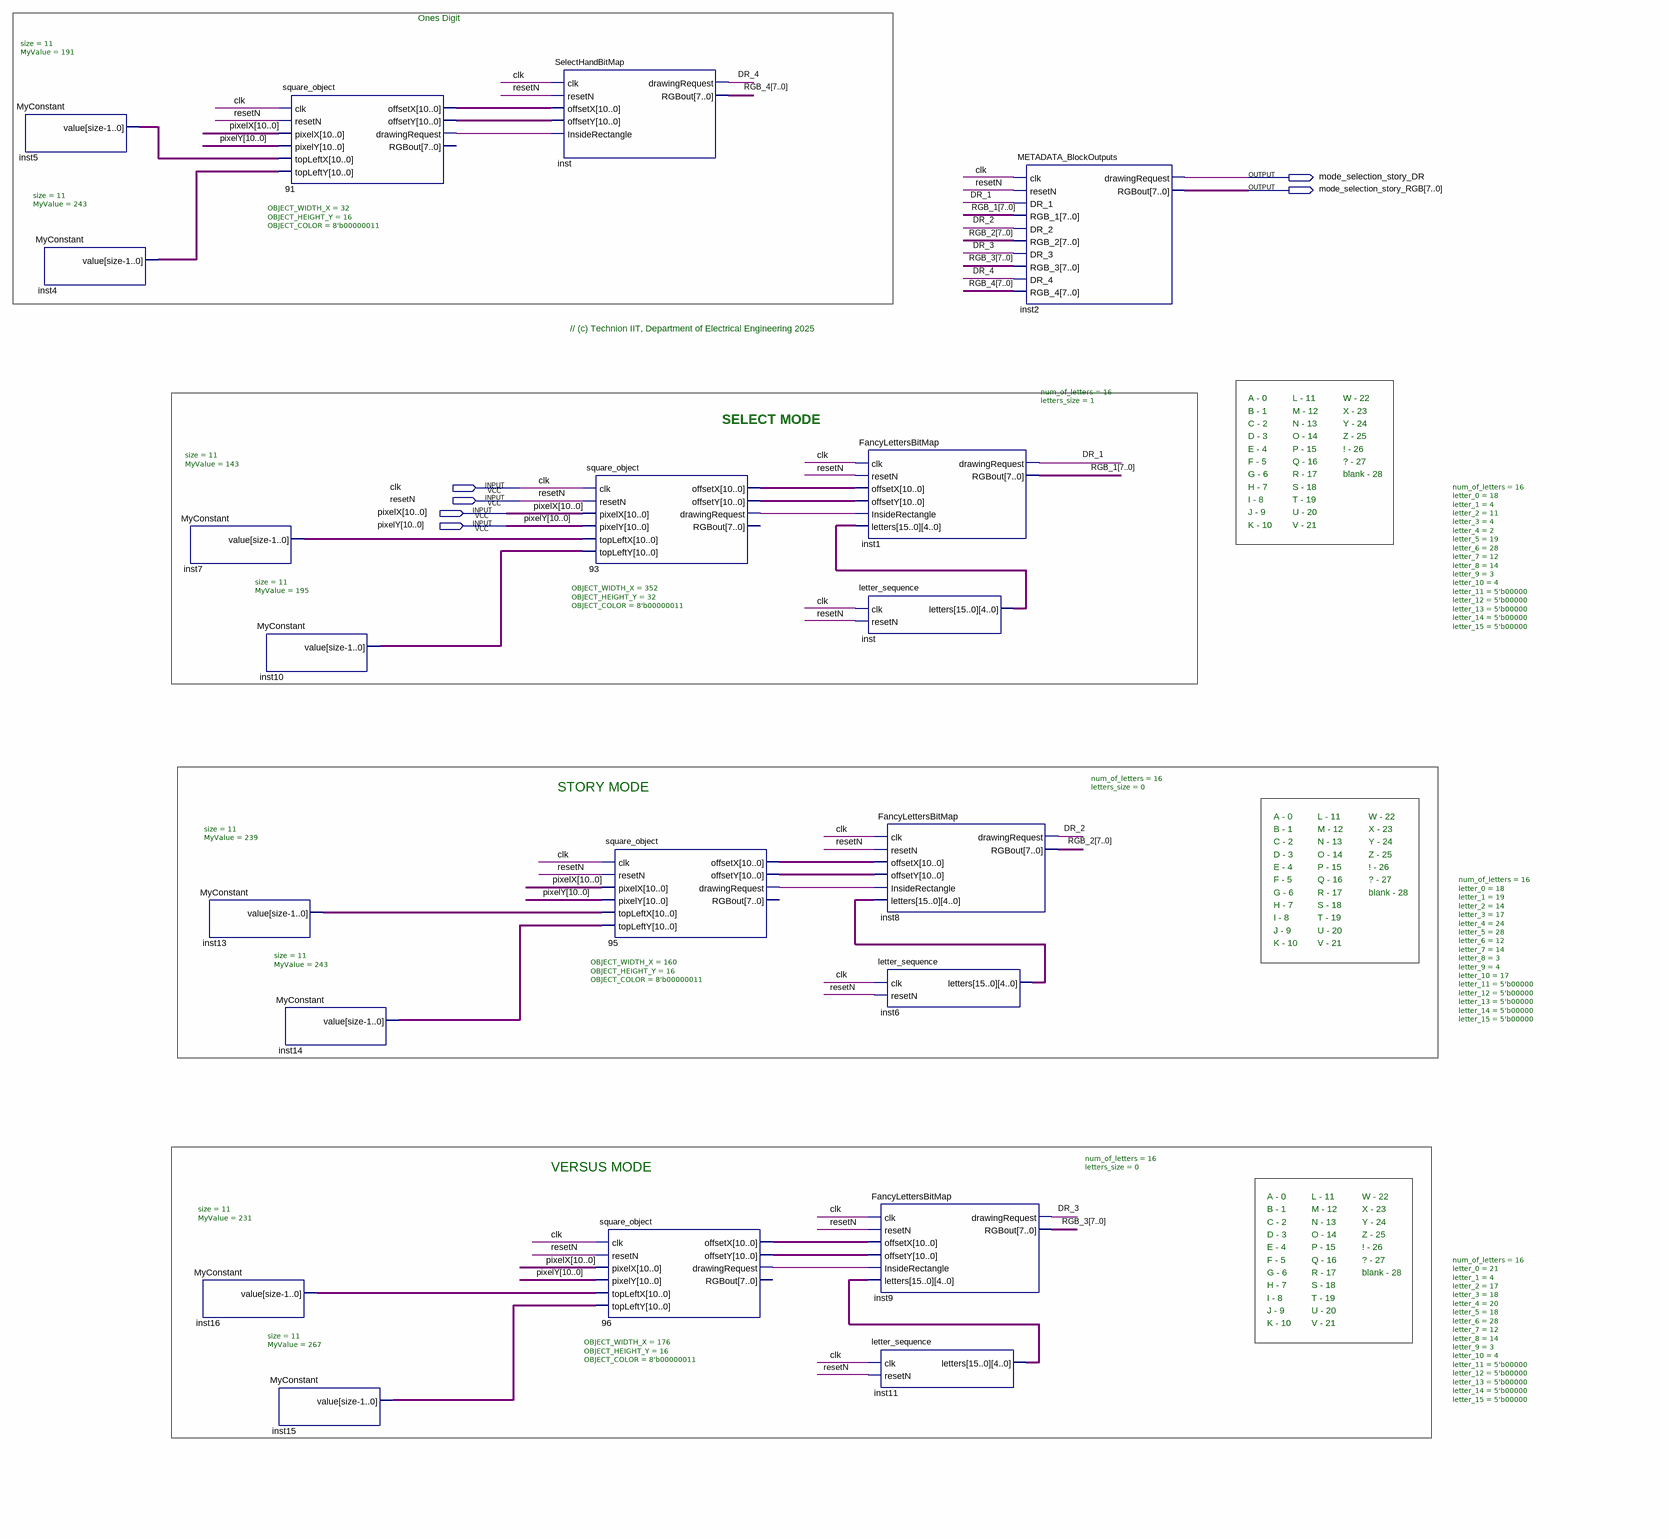
[diagram p0: schematic sheet]
// Quartus schematic Mode_Selection_Screen_Story_Block.bdf as structural Verilog: 20 symbols, 6 pins
module Mode_Selection_Screen_Story_Block (
  input  clk,
  input  resetN,
  input  [10:0] pixelX,
  input  [10:0] pixelY,
  output mode_selection_story_DR,
  output [7:0] mode_selection_story_RGB
);

  wire DR_1, DR_2, DR_3, DR_4, n91_drawingrequest, n93_drawingrequest, n95_drawingrequest, n96_drawingrequest;
  wire [7:0] RGB_1, RGB_2, RGB_3, RGB_4;
  wire [10:0] inst4_value, inst5_value, inst7_value, inst10_value, inst13_value, inst14_value, inst15_value,
       inst16_value, n91_offsetx, n91_offsety, n93_offsetx, n93_offsety, n95_offsetx, n95_offsety,
       n96_offsetx, n96_offsety;
  wire [79:0] inst6_letters, inst11_letters, inst_letters;

  MyConstant #(.size(11), .MyValue(191)) inst5 (.value(inst5_value));
  MyConstant #(.size(11), .MyValue(243)) inst4 (.value(inst4_value));
  MyConstant #(.size(11), .MyValue(143)) inst7 (.value(inst7_value));
  MyConstant #(.size(11), .MyValue(239)) inst13 (.value(inst13_value));
  MyConstant #(.size(11), .MyValue(231)) inst16 (.value(inst16_value));
  MyConstant #(.size(11), .MyValue(195)) inst10 (.value(inst10_value));
  square_object #(.OBJECT_WIDTH_X(32), .OBJECT_HEIGHT_Y(16), .OBJECT_COLOR(8'b00000011)) u_91 (
    .clk(clk), .resetN(resetN), .pixelX(pixelX), .pixelY(pixelY), .topLeftX(inst5_value),
    .topLeftY(inst4_value), .offsetX(n91_offsetx), .offsetY(n91_offsety), .drawingRequest(n91_drawingrequest));  // open: RGBout
  MyConstant #(.size(11), .MyValue(243)) inst14 (.value(inst14_value));
  MyConstant #(.size(11), .MyValue(267)) inst15 (.value(inst15_value));
  SelectHandBitMap inst (
    .clk(clk), .resetN(resetN), .offsetX(n91_offsetx), .offsetY(n91_offsety),
    .InsideRectangle(n91_drawingrequest), .drawingRequest(DR_4), .RGBout(RGB_4));
  square_object #(.OBJECT_WIDTH_X(352), .OBJECT_HEIGHT_Y(32), .OBJECT_COLOR(8'b00000011)) u_93 (
    .clk(clk), .resetN(resetN), .pixelX(pixelX), .pixelY(pixelY), .topLeftX(inst7_value),
    .topLeftY(inst10_value), .offsetX(n93_offsetx), .offsetY(n93_offsety), .drawingRequest(n93_drawingrequest));  // open: RGBout
  square_object #(.OBJECT_WIDTH_X(160), .OBJECT_HEIGHT_Y(16), .OBJECT_COLOR(8'b00000011)) u_95 (
    .clk(clk), .resetN(resetN), .pixelX(pixelX), .pixelY(pixelY), .topLeftX(inst13_value),
    .topLeftY(inst14_value), .offsetX(n95_offsetx), .offsetY(n95_offsety), .drawingRequest(n95_drawingrequest));  // open: RGBout
  square_object #(.OBJECT_WIDTH_X(176), .OBJECT_HEIGHT_Y(16), .OBJECT_COLOR(8'b00000011)) u_96 (
    .clk(clk), .resetN(resetN), .pixelX(pixelX), .pixelY(pixelY), .topLeftX(inst16_value),
    .topLeftY(inst15_value), .offsetX(n96_offsetx), .offsetY(n96_offsety), .drawingRequest(n96_drawingrequest));  // open: RGBout
  FancyLettersBitMap #(.num_of_letters(16), .letters_size(1)) inst1 (
    .clk(clk), .resetN(resetN), .offsetX(n93_offsetx), .offsetY(n93_offsety),
    .InsideRectangle(n93_drawingrequest), .letters(inst_letters), .drawingRequest(DR_1), .RGBout(RGB_1));
  letter_sequence #(.num_of_letters(16), .letter_0(18), .letter_1(4), .letter_2(11), .letter_3(4), .letter_4(2), .letter_5(19), .letter_6(28), .letter_7(12), .letter_8(14), .letter_9(3), .letter_10(4), .letter_11(5'b00000), .letter_12(5'b00000), .letter_13(5'b00000), .letter_14(5'b00000), .letter_15(5'b00000)) inst_dup2 (
    .clk(clk), .resetN(resetN), .letters(inst_letters));
  FancyLettersBitMap #(.num_of_letters(16), .letters_size(0)) inst9 (
    .clk(clk), .resetN(resetN), .offsetX(n96_offsetx), .offsetY(n96_offsety),
    .InsideRectangle(n96_drawingrequest), .letters(inst11_letters), .drawingRequest(DR_3), .RGBout(RGB_3));
  letter_sequence #(.num_of_letters(16), .letter_0(21), .letter_1(4), .letter_2(17), .letter_3(18), .letter_4(20), .letter_5(18), .letter_6(28), .letter_7(12), .letter_8(14), .letter_9(3), .letter_10(4), .letter_11(5'b00000), .letter_12(5'b00000), .letter_13(5'b00000), .letter_14(5'b00000), .letter_15(5'b00000)) inst11 (
    .clk(clk), .resetN(resetN), .letters(inst11_letters));
  FancyLettersBitMap #(.num_of_letters(16), .letters_size(0)) inst8 (
    .clk(clk), .resetN(resetN), .offsetX(n95_offsetx), .offsetY(n95_offsety),
    .InsideRectangle(n95_drawingrequest), .letters(inst6_letters), .drawingRequest(DR_2), .RGBout(RGB_2));
  letter_sequence #(.num_of_letters(16), .letter_0(18), .letter_1(19), .letter_2(14), .letter_3(17), .letter_4(24), .letter_5(28), .letter_6(12), .letter_7(14), .letter_8(3), .letter_9(4), .letter_10(17), .letter_11(5'b00000), .letter_12(5'b00000), .letter_13(5'b00000), .letter_14(5'b00000), .letter_15(5'b00000)) inst6 (
    .clk(clk), .resetN(resetN), .letters(inst6_letters));
  METADATA_BlockOutputs inst2 (
    .clk(clk), .resetN(resetN), .DR_1(DR_1), .RGB_1(RGB_1), .DR_2(DR_2), .RGB_2(RGB_2), .DR_3(DR_3),
    .RGB_3(RGB_3), .DR_4(DR_4), .RGB_4(RGB_4), .drawingRequest(mode_selection_story_DR),
    .RGBout(mode_selection_story_RGB));

  // Notes on the sheet:
  //   Ones Digit 
  //   // (c) Technion IIT, Department of Electrical Engineering 2025
  //   A - 0
  //   L - 11
  //   W - 22
  //   B - 1
  //   M - 12
  //   X - 23
  //   SELECT MODE
  //   C - 2
  //   N - 13
  //   Y - 24
  //   D - 3
  //   O - 14
  //   Z - 25
  //   E - 4
  //   P - 15
  //   ! - 26
  //   F - 5
  //   Q - 16
  //   ? - 27
  //   G - 6
  //   R - 17
  //   blank - 28
  //   H - 7
  //   S - 18
  //   I - 8
  //   T - 19
  //   J - 9
  //   U - 20
  //   K - 10
  //   V - 21
  //   STORY MODE
  //   A - 0
  //   L - 11
  //   W - 22
  //   B - 1
  //   M - 12
  //   X - 23
  //   C - 2
  //   N - 13
  //   Y - 24
  //   D - 3
  //   O - 14
  //   Z - 25
  //   E - 4
  //   P - 15
  //   ! - 26
  //   F - 5
  //   Q - 16
  //   ? - 27
  //   G - 6
  //   R - 17
  //   blank - 28
  //   H - 7
  //   S - 18
  //   I - 8
  //   T - 19
  //   J - 9
  //   U - 20
  //   K - 10
  //   V - 21
  //   VERSUS MODE
  //   A - 0
  //   L - 11
  //   W - 22
  //   B - 1
  //   M - 12
  //   X - 23
  //   C - 2
  //   N - 13
  //   Y - 24
  //   D - 3
  //   O - 14
  //   Z - 25
  //   E - 4
  //   P - 15
  //   ! - 26
  //   F - 5
  //   Q - 16
  //   ? - 27
  //   G - 6
  //   R - 17
  //   blank - 28
  //   H - 7
  //   S - 18
  //   I - 8
  //   T - 19
  //   J - 9
  //   U - 20
  //   K - 10
  //   V - 21
endmodule
